# Altium schematic sheet [5] Flash.SchDoc: Serial Flash
size A4; ApprovedBy: Muhammet YILDIZ; CheckedBy: Muhammet YILDIZ; Author: Muhammet YILDIZ; CompanyName: YıLDıZ IoT; DrawnBy: Muhammet YILDIZ; Engineer: Muhammet YILDIZ; Organization: YıLDıZ IoT; Address1: Elperek Mahallesi; Address2: Saray Sokak No:12; Address3: SAKARYA / TURKEY; Revision: 1; SheetNumber: 5; SheetTotal: 7; SheetSize: A4
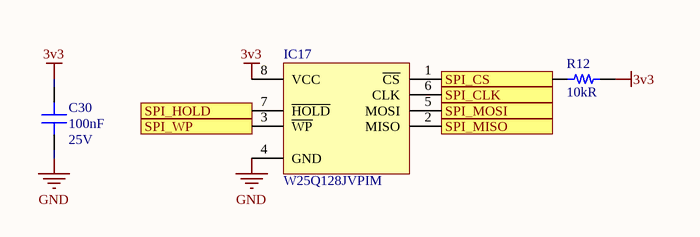
[diagram p0: [5] Flash.SchDoc]

## Parts
C30  100nF  Voltage Rating (DC): 25V  [CAP 0402/1005]
IC17  W25Q128JVPIM  [WINBOND WSON-8 6x5mm]
R12  10kR  [RES 0402/1005]

## Ports
SPI_CLK (in), SPI_CS (in), SPI_HOLD (in), SPI_MISO (out), SPI_MOSI (in), SPI_WP (in)

## Nets
3v3: C30.2 IC17.8(VCC) R12.2
GND: C30.1 IC17.4(GND)
SPI_CLK: IC17.6(CLK) ; port SPI_CLK
SPI_CS: IC17.1(~{CS}) R12.1 ; port SPI_CS
SPI_HOLD: IC17.7(~{HOLD}) ; port SPI_HOLD
SPI_MISO: IC17.2(MISO) ; port SPI_MISO
SPI_MOSI: IC17.5(MOSI) ; port SPI_MOSI
SPI_WP: IC17.3(~{WP}) ; port SPI_WP

## Notes on the sheet
- Title:
- Size:
- Project:
- Revision:
- Sheet
- of
- Date:
- YıLDıZ IoT
- Elperek Mahallesi
- Saray Sokak, No:12
- SAKARYA / TURKEY
- File:

## Library data of the parts
C30 = Capacitor - Ceramic: Cap Ceramic 0.1uF 25V X5R 10% Pad SMD 0402 85¡ãC T/R / Multi Layer Ceramic Capacitor (MLCC); Manufacturer: Samsung; Manufacturer Part Number: CL05A104KA5NNNC; Supplier 1: Digi-Key; Supplier Part Number 1: 1276-1043-6-ND; RoHS: Yes; Category: Ceramic Capacitors; Pricing 1: 1=0,10000, 10=0,01100, 50=0,00600, 100=0,00490, 500=0,00346, 1000=0,00272, 2500=0,00248, 5000=0,00228 (USD); Mount: Surface Mount; Case/Package: 0402; Case Code (Imperial): 0402; Case Code (Metric): 1005; Min Operating Temperature: -55°C; Max Operating Temperature: 85°C; Capacitance: 100nF; Packaging: Tape and Reel; Tolerance: 10%; Package Quantity: 1; Voltage Rating: 25V; Dielectric: X5R; Voltage: 25V; Length: 1mm; Width: 0.02inch; Height: 0.5mm; Thickness: 0.022inch; Depth: 0.5mm; Radiation Hardening: No; Lead Free: Lead Free; ComponentLink1URL: https://datasheet.ciiva.com/25802/cl05a104ka5nnnc-25802704.pdf?src-supplier=Digi-Key; ComponentLink1Description: https://datasheet.ciiva.com/25802/cl05a104ka5nnnc-25802704.pdf?src-supplier=Digi-Key; ComponentLink2URL: https://datasheet.ciiva.com/16437/cl05a104ka5nnnc-16437369.pdf?src-supplier=Future+Electronics; ComponentLink2Description: https://datasheet.ciiva.com/16437/cl05a104ka5nnnc-16437369.pdf?src-supplier=Future+Electronics; ComponentLink3URL: https://datasheet.ciiva.com/26838/getdatasheetpartid-357412-26838142.pdf?src-supplier=Verical; ComponentLink3Description: https://datasheet.ciiva.com/26838/getdatasheetpartid-357412-26838142.pdf?src-supplier=Verical; ComponentLink4URL: https://datasheet.ciiva.com/26309/mlcc-catalogdownload2013-eng-26309014.pdf?src-supplier=Distrelec; ComponentLink4Description: https://datasheet.ciiva.com/26309/mlcc-catalogdownload2013-eng-26309014.pdf?src-supplier=Distrelec
IC17 = WINBOND FLASH SPI 8PIN: NOR Flash Serial (SPI, Dual SPI, Quad SPI) 3V/3.3V 128M-bit 16M x 8 6ns 8-Pin WSON EP T/R/Tray/Tube; Supplier 1: Digi-Key; Supplier Part Number 1: W25Q128JVPIM-ND; Manufacturer: Winbond; Manufacturer Part Number: W25Q128JVPIM; RoHS: Yes; Category: Memory; Stock 1: 40934; Pricing 1: 1=1.97000, 10=1.79800, 25=1.74960, 50=1.74080, 100=1.55600, 250=1.55152, 500=1.52810, 1000=1.46322, 5000=1.36231 (USD); RoHS Compliant: Yes; ComponentLink1URL: http://www.winbond.com/resource-files/w25q128jv_dtr%20revc%2003272018%20plus.pdf?src-supplier=Digi-Key; ComponentLink1Description: http://www.winbond.com/resource-files/w25q128jv_dtr%20revc%2003272018%20plus.pdf?src-supplier=Digi-Key
R12 = Resistor_Chip: Res Thick Film 0402 10K Ohm 1% 0.063W(1/16W) ±100ppm/C Pad SMD Automotive T/R; Manufacturer: Stackpole Electronics; Manufacturer Part Number: RMCF0402FT10K0; Power Rating: 62.5mW; Temperature Coefficient: 100ppm/°C; Max Power Dissipation: 63mW; Supplier 1: Digi-Key; Supplier Part Number 1: RMCF0402FT10K0CT-ND; RoHS: Yes; Category: Chip SMD Resistors; Pricing 1: 1=0,10000, 10=0,01500, 100=0,00610, 1000=0,00274, 2500=0,00238, 5000=0,00197 (USD); Mount: Surface Mount; Case/Package: 0402; Case Code (Metric): 1005; Case Code (Imperial): 0402; Contact Plating: Tin,Matte; Size Code: 0402; Min Operating Temperature: -55°C; Max Operating Temperature: 155°C; Tolerance: 1%; Packaging: Tape and Reel; Resistance: 10kR; Resistor Type: Thick Film; Number of Terminations: 2; Features: Automotive AEC-Q200; Series: RMCF; Construction: Rectangular; Length: 1mm; Width: 0.02inch; Height: 0.016inch; Depth: 0.5mm; Radiation Hardening: No; Military Standard: Not; Lead Free: Lead Free; RoHS Compliant: Yes; ComponentLink1URL: https://datasheet.ciiva.com/24341/sei-rmcp-24341800.pdf?src-supplier=Onlinecomponents.com; ComponentLink1Description: https://datasheet.ciiva.com/24341/sei-rmcp-24341800.pdf?src-supplier=Onlinecomponents.com